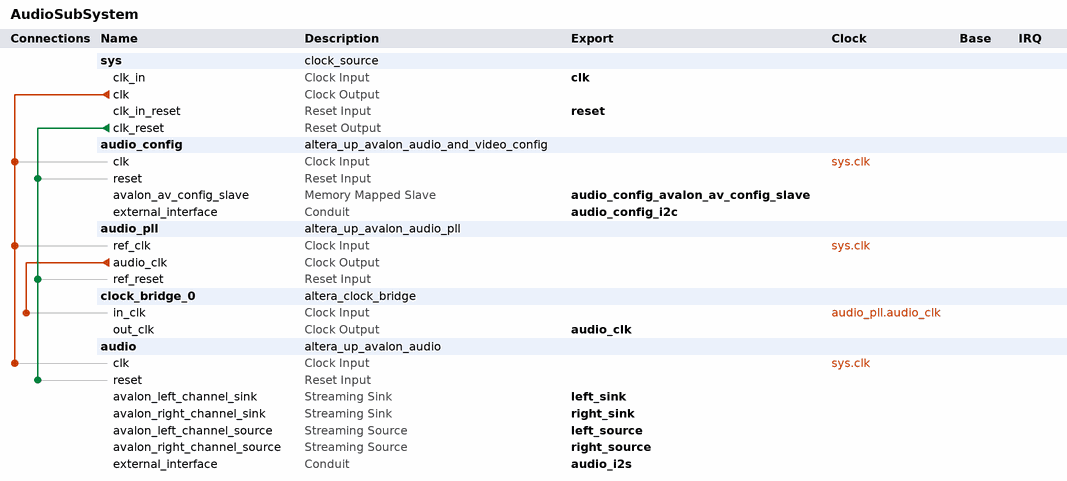
[diagram p0: system contents]
# Platform Designer (Qsys) system AudioSubSystem, Cyclone V 5CSEMA5F31C6
# Parameters at their usual value, and those the tool derives, are not listed.
package require -exact qsys 16.1
create_system AudioSubSystem
set_project_property DEVICE_FAMILY {Cyclone V}
set_project_property DEVICE 5CSEMA5F31C6

add_instance sys clock_source 16.1
set_instance_parameter_value sys clockFrequency 50000000

add_instance audio_config altera_up_avalon_audio_and_video_config 16.1
set_instance_parameter_value audio_config audio_in {Line In to ADC}
set_instance_parameter_value audio_config bit_length 24
set_instance_parameter_value audio_config board DE1-SoC
set_instance_parameter_value audio_config line_in_bypass false
set_instance_parameter_value audio_config sampling_rate {48 kHz}

add_instance audio_pll altera_up_avalon_audio_pll 16.1
set_instance_parameter_value audio_pll gui_refclk 50.0

add_instance clock_bridge_0 altera_clock_bridge 16.1
set_instance_parameter_value clock_bridge_0 DERIVED_CLOCK_RATE 12288135
set_instance_parameter_value clock_bridge_0 EXPLICIT_CLOCK_RATE 0

add_instance audio altera_up_avalon_audio 16.1
set_instance_parameter_value audio audio_in true
set_instance_parameter_value audio avalon_bus_type Streaming
set_instance_parameter_value audio dw 24

# connections
add_connection audio_pll.audio_clk clock_bridge_0.in_clk clock
add_connection sys.clk audio.clk clock
add_connection sys.clk audio_config.clk clock
add_connection sys.clk audio_pll.ref_clk clock
add_connection sys.clk_reset audio.reset reset
add_connection sys.clk_reset audio_config.reset reset
add_connection sys.clk_reset audio_pll.ref_reset reset

# exported interfaces
add_interface audio_clk clock source
set_interface_property audio_clk EXPORT_OF clock_bridge_0.out_clk
add_interface audio_config_avalon_av_config_slave avalon slave
set_interface_property audio_config_avalon_av_config_slave EXPORT_OF audio_config.avalon_av_config_slave
add_interface audio_config_i2c conduit end
set_interface_property audio_config_i2c EXPORT_OF audio_config.external_interface
add_interface audio_i2s conduit end
set_interface_property audio_i2s EXPORT_OF audio.external_interface
add_interface clk clock sink
set_interface_property clk EXPORT_OF sys.clk_in
add_interface left_sink avalon_streaming sink
set_interface_property left_sink EXPORT_OF audio.avalon_left_channel_sink
add_interface left_source avalon_streaming source
set_interface_property left_source EXPORT_OF audio.avalon_left_channel_source
add_interface reset reset sink
set_interface_property reset EXPORT_OF sys.clk_in_reset
add_interface right_sink avalon_streaming sink
set_interface_property right_sink EXPORT_OF audio.avalon_right_channel_sink
add_interface right_source avalon_streaming source
set_interface_property right_source EXPORT_OF audio.avalon_right_channel_source

set_interconnect_requirement {$system} qsys_mm.clockCrossingAdapter HANDSHAKE
set_interconnect_requirement {$system} qsys_mm.enableEccProtection FALSE
set_interconnect_requirement {$system} qsys_mm.insertDefaultSlave FALSE
set_interconnect_requirement {$system} qsys_mm.maxAdditionalLatency 1

save_system AudioSubSystem.qsys
